# Altium project E.Steth.PrjPcb
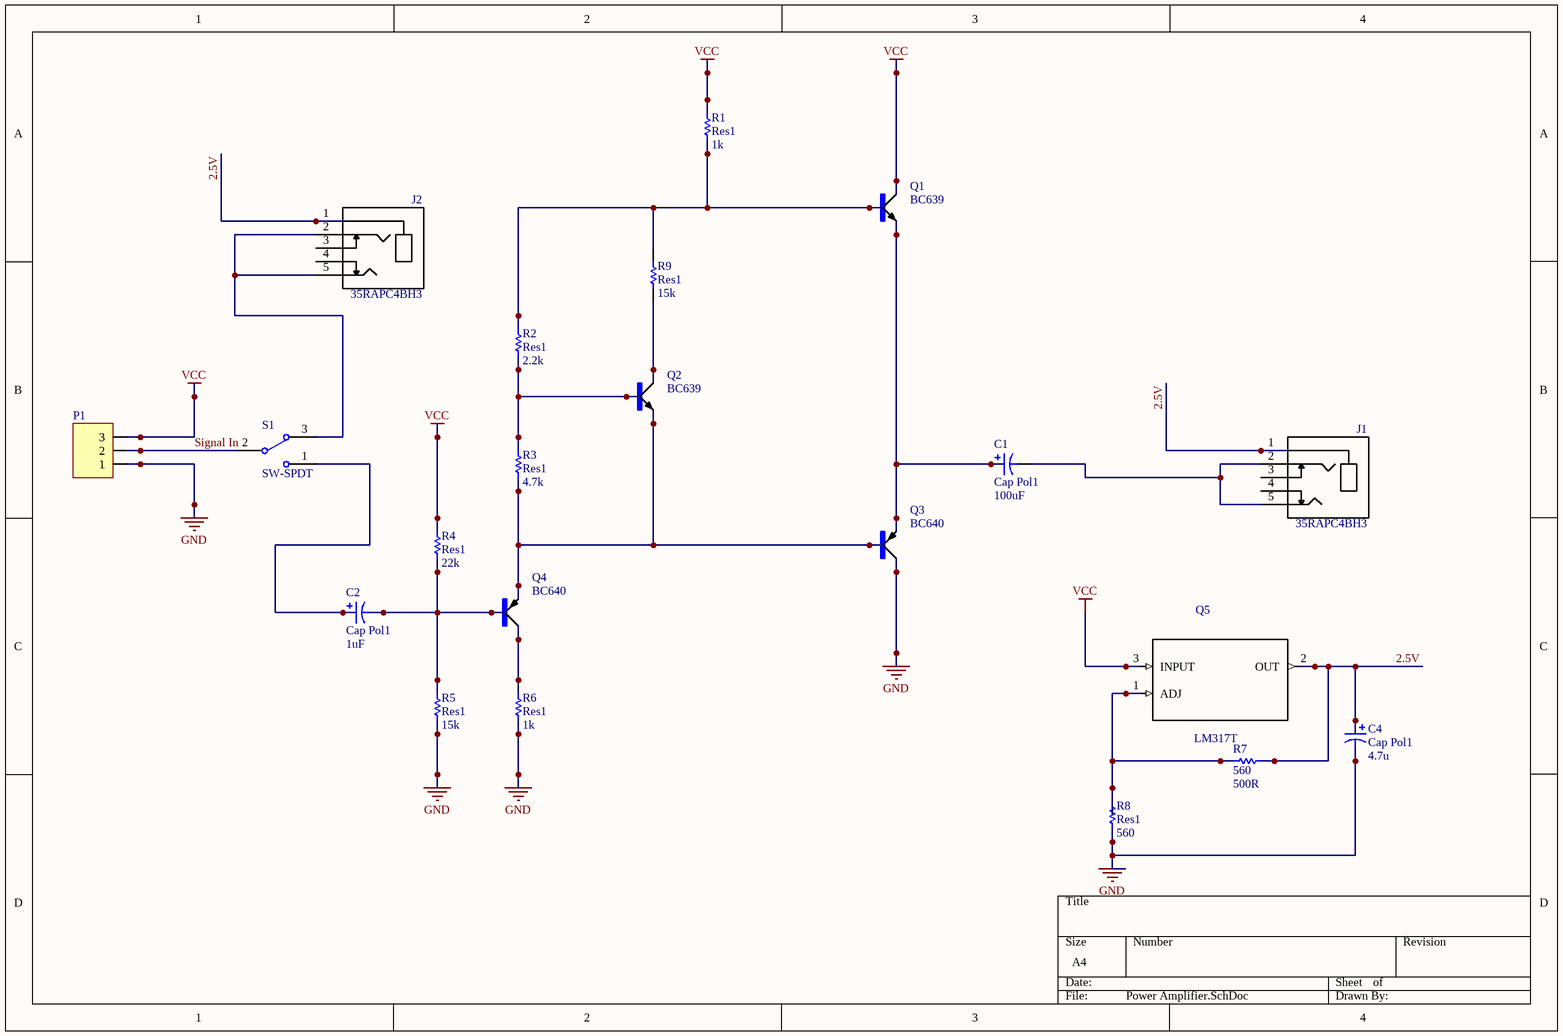
[diagram p0: Power Amplifier.SchDoc]
1 sheet, 21 parts. Net scope: global (net labels, ports and power ports of the same name join across sheets).
Board file: Power Amplifier.PcbDoc

## Sheet Power Amplifier.SchDoc
size A4

### Parts
C1  Cap Pol1  value 100uF  [Capacitor 5mmx11mm]
C2  Cap Pol1  value 1uF  [Capacitor 5mmx11mm]
C4  Cap Pol1  value 4.7u  [Capacitor 5mmx11mm]
J1  35RAPC4BH3  [*SWITCHCRAFT_35RAPC4BH3]
J2  35RAPC4BH3  [*SWITCHCRAFT_35RAPC4BH3]
P1  (no value)  [HDR1X3]
Q1  BC639  [*SOT54D_BC639(Primary)]
Q2  BC639  [*SOT54D_BC639(Primary)]
Q3  BC640  [*TO92127P520H534-3]
Q4  BC640  [*SOT54D_BC640(Primary)]
Q5  LM317T  [TO254P450X1020X2000-3P]
R1  Res1  value 1k  [AXIAL-0.3]
R2  Res1  value 2.2k  [AXIAL-0.3]
R3  Res1  value 4.7k  [AXIAL-0.3]
R4  Res1  value 22k  [AXIAL-0.3]
R5  Res1  value 15k  [AXIAL-0.3]
R6  Res1  value 1k  [AXIAL-0.3]
R7  560  value 500R  [AXIAL-0.3]
R8  Res1  value 560  [AXIAL-0.3]
R9  Res1  value 15k  [AXIAL-0.3]
S1  SW-SPDT  [HDR1X3]

### Nets
GND: C4.2 P1.1 Q3.C R5.1 R6.1 R8.1
VCC: P1.3 Q1.C Q5.3(INPUT) R1.2 R4.2
2.5V: C4.1 J1.1 J2.1 Q5.2(OUT) R7.2
Signal In: P1.2 S1.2
NetC1_1: C1.1 Q1.E Q3.E
NetC1_2: C1.2 J1.2 J1.5
NetC2_1: C2.1 S1.1
NetC2_2: C2.2 Q4.B R4.1 R5.2
NetJ2_2: J2.2 J2.5 S1.3
NetQ1_B: Q1.B R1.1 R2.2 R9.2
NetQ2_B: Q2.B R2.1 R3.2
NetQ2_C: Q2.C R9.1
NetQ2_E: Q2.E Q3.B Q4.E R3.1
NetQ4_C: Q4.C R6.2
NetQ5_1: Q5.1(ADJ) R7.1 R8.2

Not connected (* = marked no-connect by the designer): J1 3 4; J2 3 4

### Library data of the parts
C1 C2 C4 = Cap Pol1: Polarized Capacitor (Radial); Published: 8-Jun-2000; LatestRevisionDate: 17-Jul-2002; LatestRevisionNote: Re-released for DXP Platform.; PackageReference: RB7.6-15; Publisher: Altium Limited; PackageDescription: Polarized Capacitor (Radial); 2 Leads
J1 J2 = 35RAPC4BH3: 3.50mm _0.141, 1/8, Mini Plug_ - Headphone Phone Jack Stereo _3 Conductor, TRS_ Connector Solder; MF: Switchcraft Inc.; SnapEDA_Link: https://www.snapeda.com/parts/35RAPC4BH3/Switchcraft%20Inc./view-part/621325/?ref=snap; Availability: Unavailable; Package: None; MP: 35RAPC4BH3; Price: None; Value: *
P1 = Header 3: Header, 3-Pin; LatestRevisionDate: 17-Jul-2002; LatestRevisionNote: Re-released for DXP Platform.; Publisher: Altium Limited
Q1 Q2 = BC639: Bipolar _BJT_ Transistor NPN 80V 1A 200MHz 625mW Through Hole TO-92-3; MF: ON Semiconductor; MP: BC639; Price: None; SnapEDA_Link: https://www.snapeda.com/parts/BC639/ON%20Semiconductor/view-part/761111/?ref=snap; Package: TO-92 Continental Device; Availability: Unavailable; Value: *
Q3 Q4 = BC640: Bipolar _BJT_ Transistor PNP 80V 500mA 150MHz 625mW Through Hole TO-92-3; MF: ON Semiconductor; SnapEDA_Link: https://www.snapeda.com/parts/BC640/ON%20Semiconductor/view-part/2782146/?ref=snap; MP: BC640; Availability: Unavailable; Price: None; Package: TO-92 Continental Device; Value: *
Q5 = LM317T: MF: Texas Instruments; SnapEDA_Link: https://www.snapeda.com/parts/LM317T/Texas%20Instruments/view-part/?ref=snap; Digi-Key_Purchase_URL: https://www.digikey.lk/product-detail/en/texas-instruments/LM317T/LM317T-ND/3701346?utm_source=snapeda&utm_medium=aggregator&utm_campaign=symbol; Package: TO-220-3 HTC Korea; MP: LM317T; Digi-Key_Part_Number: LM317T-ND; Value: *
R1-R9 = Res1: Resistor; Published: 8-Jun-2000; LatestRevisionDate: 17-Jul-2002; LatestRevisionNote: Re-released for DXP Platform.; PackageReference: AXIAL-0.3; Publisher: Altium Limited; PackageDescription: Axial Device, Thru-Hole; 2 Leads; 0.3 in Pin Spacing
S1 = SW-SPDT: SPDT Subminiature Toggle Switch, Right Angle Mounting, Vertical Actuation; Published: 24-Mar-1999; LatestRevisionDate: 17-Dec-2003; LatestRevisionNote: Schematic revised, PCB Footprint replaced.; DatasheetVersion: 05-Dec-2000; PackageReference: TL36WW15050; Publisher: Altium Limited; PackageDescription: Switch; 4 Leads; ComponentLink1Description: Manufacturer Link; ComponentLink1URL: http://www.apem.com